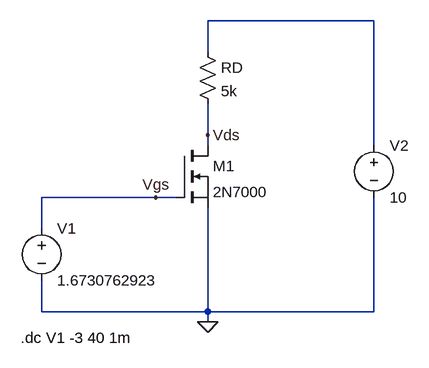
[diagram p0: schematic Circuito_MOSFET_Enrich_Curva_Entrada.asc]
Circuito_MOSFET_Enrich_Curva_Entrada.asc, the LTspice schematic file:
Version 4
SHEET 1 880 680
WIRE 448 -80 192 -80
WIRE 192 -32 192 -80
WIRE 192 96 192 48
WIRE 192 112 192 96
WIRE 448 112 448 -80
WIRE 112 192 -64 192
WIRE 144 192 112 192
WIRE -64 240 -64 192
WIRE -64 368 -64 320
WIRE 192 368 192 208
WIRE 192 368 -64 368
WIRE 448 368 448 192
WIRE 448 368 192 368
WIRE 192 384 192 368
FLAG 192 384 0
FLAG 192 96 Vds
FLAG 112 192 Vgs
SYMBOL nmos 144 112 R0
SYMATTR InstName M1
SYMATTR Value 2N7000
SYMBOL voltage -64 224 R0
WINDOW 123 0 0 Left 0
WINDOW 39 0 0 Left 0
SYMATTR InstName V1
SYMATTR Value 1.6730762923
SYMBOL voltage 448 96 R0
WINDOW 123 0 0 Left 0
WINDOW 39 0 0 Left 0
SYMATTR InstName V2
SYMATTR Value 10
SYMBOL res 176 -48 R0
SYMATTR InstName RD
SYMATTR Value 5k
TEXT -96 408 Left 2 !.dc V1 -3 40 1m

The netlist it stands for:
* Circuito_MOSFET_Enrich_Curva_Entrada.asc
M1 Vds Vgs 0 0 2N7000
V1 Vgs 0 1.6730762923
V2 N001 0 10
RD N001 Vds 5k
.model NMOS NMOS
.model PMOS PMOS
.lib standard.mos
.dc V1 -3 40 1m
.backanno
.end

* Results of the author's LTspice run, read from the files saved beside the schematic
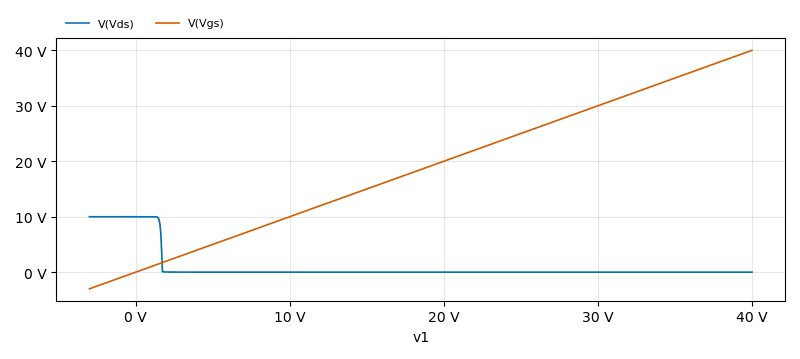
[diagram p1: DC transfer characteristic of Circuito_MOSFET_Enrich_Curva_Entrada.asc, plotted from the saved traces]
* DC transfer characteristic, 1 run:
*   V(Vds): 10 V at v1=-3 V, 1.745 mV at v1=40 V, min 1.745 mV, max 10 V
*   V(Vgs): -3 V at v1=-3 V, 40 V at v1=40 V, min -3 V, max 40 V